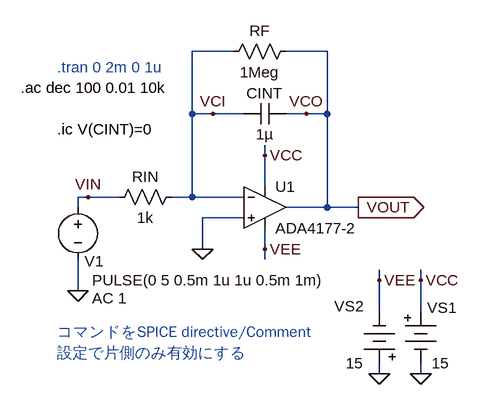
[diagram p0: schematic fig-01-03-24(c).asc]
fig-01-03-24(c).asc, the LTspice schematic file:
Version 4
SHEET 1 880 680
WIRE 160 -64 96 -64
WIRE 304 -64 240 -64
WIRE 96 32 96 -64
WIRE 128 32 96 32
WIRE 176 32 128 32
WIRE 272 32 240 32
WIRE 304 32 304 -64
WIRE 304 32 272 32
WIRE 208 96 208 80
WIRE 208 144 208 96
WIRE -64 160 -80 160
WIRE -16 160 -64 160
WIRE 96 160 96 32
WIRE 96 160 64 160
WIRE 176 160 96 160
WIRE -80 176 -80 160
WIRE 304 176 304 32
WIRE 304 176 240 176
WIRE 352 176 304 176
WIRE 176 192 112 192
WIRE 112 240 112 192
WIRE 208 240 208 208
WIRE 208 256 208 240
WIRE 384 288 384 272
WIRE 448 288 448 272
WIRE -80 304 -80 256
WIRE 384 336 384 288
WIRE 448 336 448 288
WIRE 384 432 384 416
WIRE 448 432 448 416
FLAG -80 304 0
FLAG -64 160 VIN
FLAG 384 432 0
FLAG 448 432 0
FLAG 384 288 VEE
FLAG 448 288 VCC
FLAG 208 96 VCC
FLAG 208 240 VEE
FLAG 352 176 VOUT
IOPIN 352 176 Out
FLAG 112 240 0
FLAG 128 32 VCI
FLAG 272 32 VCO
SYMBOL voltage -80 160 R0
WINDOW 0 10 99 Left 2
WINDOW 3 22 128 Left 2
WINDOW 123 22 156 Left 2
WINDOW 39 0 0 Left 0
SYMATTR InstName V1
SYMATTR Value PULSE(0 5 0.5m 1u 1u 0.5m 1m)
SYMATTR Value2 AC 1
SYMBOL Misc\\battery 448 320 R0
WINDOW 0 10 10 Left 2
WINDOW 3 17 96 Left 2
SYMATTR InstName VS1
SYMATTR Value 15
SYMBOL Misc\\battery 384 432 R180
WINDOW 0 24 104 Left 2
WINDOW 3 24 16 Left 2
SYMATTR InstName VS2
SYMATTR Value 15
SYMBOL res 80 144 R90
WINDOW 0 0 56 VBottom 2
WINDOW 3 32 56 VTop 2
SYMATTR InstName RIN
SYMATTR Value 1k
SYMBOL res 256 -80 R90
WINDOW 0 0 56 VBottom 2
WINDOW 3 32 56 VTop 2
SYMATTR InstName RF
SYMATTR Value 1Meg
SYMBOL cap 240 16 R90
WINDOW 0 0 32 VBottom 2
WINDOW 3 32 32 VTop 2
SYMATTR InstName CINT
SYMATTR Value 1µ
SYMBOL Opamps\\ADA4177-2 208 176 R0
SYMATTR InstName U1
TEXT -112 -40 Left 2 ;.tran 0 2m 0 1u
TEXT -168 -8 Left 2 !.ac dec 100 0.01 10k
TEXT -112 368 Left 2 ;コマンドをSPICE directive/Comment
TEXT -112 400 Left 2 ;設定で片側のみ有効にする
TEXT -112 56 Left 2 !.ic V(CINT)=0

The netlist it stands for:
* fig-01-03-24(c).asc
V1 VIN 0 PULSE(0 5 0.5m 1u 1u 0.5m 1m) AC 1
VS1 VCC 0 15
VS2 0 VEE 15
RIN VCI VIN 1k
RF VCO VCI 1Meg
CINT VCO VCI 1µ
* U1: ADA4177-2 (symbol Opamps\ADA4177-2 not available, pins judged from their places): In+=0 In-=VCI V+=VCC V-=VEE OUT=VCO
* .tran 0 2m 0 1u
.ac dec 100 0.01 10k
* コマンドをSPICE directive/Comment
* 設定で片側のみ有効にする
.ic V(CINT)=0
.backanno
.end